# EAGLE design Cube-CTRL (EAGLE 5.11)
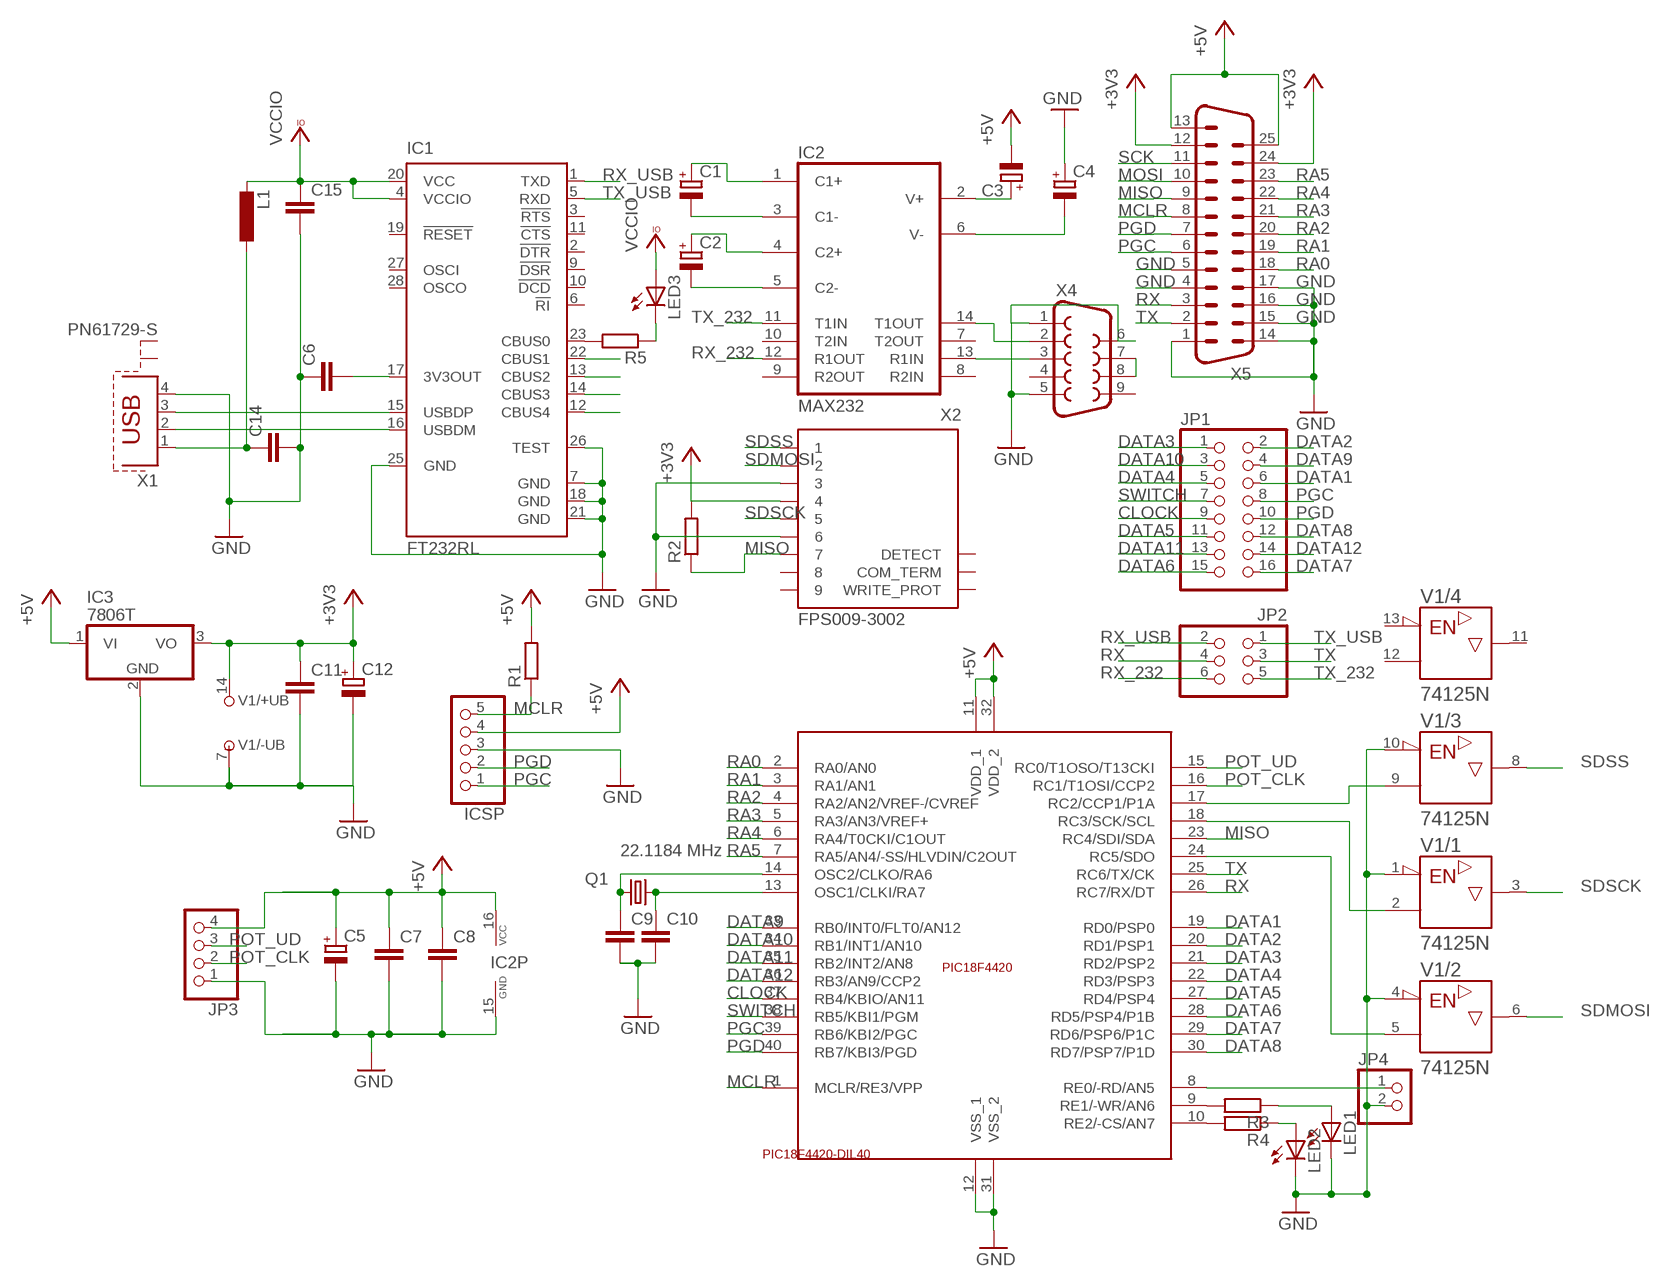
[diagram p0: schematic, sheet 1]

## Parts
C1  CPOL-EUE2-4  [E2-4]
C2  CPOL-EUE2-4  [E2-4]
C3  CPOL-EUE2-4  [E2-4]
C4  CPOL-EUE2-4  [E2-4]
C5  CPOL-EUE2.5-6  [E2,5-6]
C6  C-EU050-024X044  [C050-024X044]
C7  C-EU050-024X044  [C050-024X044]
C8  C-EU050-024X044  [C050-024X044]
C9  C-EU050-024X044  [C050-024X044]
C10  C-EU050-024X044  [C050-024X044]
C11  C-EU050-024X044  [C050-024X044]
C12  CPOL-EUE2.5-6  [E2,5-6]
C14  C-EU050-024X044  [C050-024X044]
C15  C-EU050-024X044  [C050-024X044]
IC1  FT232RL  [SSOP28]
IC2  MAX232  [DIL16]
IC3  7806T  [TO220H]
ICSP  PINHD-1X5  [1X05]
JP1  PINHD-2X8  [2X08]
JP2  PINHD-2X3  [2X03]
JP3  PINHD-1X4  [1X04]
JP4  PINHD-1X2  [1X02]
L1  L-EU0204/7  [0204/7]
LED1  LED3MM  [LED3MM]
LED2  LED3MM  [LED3MM]
LED3  LED3MM  [LED3MM]
Q1  22.1184 MHz  CRYSTALHC49S  [HC49/S]
R1  R-EU_0207/7  [0207/7]
R2  R-EU_0207/7  [0207/7]
R3  R-EU_0207/7  [0207/7]
R4  R-EU_0207/7  [0207/7]
R5  R-EU_0207/7  [0207/7]
U$1  PIC18F4420-DIL40  [DIL40]
V1  74125N  [DIL14]
X1  PN61729-S  [PN61729-S]
X2  FPS009-3002  [FPS009-3000]
X4  F09HP  [F09HP]
X5  M25H  [M25H]

## Nets
+3V3: C11.1 C12.+ IC3.3(VO) R2.2 V1.14(/+UB:+UB) X2.4 X5.12 X5.24
+5V [PWR]: C3.- C5.+ C7.1 C8.1 IC2.16(VCC) IC3.1(VI) ICSP.4 JP3.4 R1.2 U$1.11(VDD_1) U$1.32(VDD_2) X5.13 X5.25
CLOCK: JP1.9 U$1.37(RB4/KBIO/AN11)
DATA1: JP1.6 U$1.19(RD0/PSP0)
DATA2: JP1.2 U$1.20(RD1/PSP1)
DATA3: JP1.1 U$1.21(RD2/PSP2)
DATA4: JP1.5 U$1.22(RD3/PSP3)
DATA5: JP1.11 U$1.27(RD4/PSP4)
DATA6: JP1.15 U$1.28(RD5/PSP4/P1B)
DATA7: JP1.16 U$1.29(RD6/PSP6/P1C)
DATA8: JP1.12 U$1.30(RD7/PSP7/P1D)
DATA9: JP1.4 U$1.33(RB0/INT0/FLT0/AN12)
DATA10: JP1.3 U$1.34(RB1/INT1/AN10)
DATA11: JP1.13 U$1.35(RB2/INT2/AN8)
DATA12: JP1.14 U$1.36(RB3/AN9/CCP2)
GND [PWR]: C4.+ C5.- C6.1 C7.2 C8.2 C9.2 C10.2 C11.2 C12.- C14.2 C15.2 IC1.7(GND) IC1.18(GND) IC1.21(GND) IC1.25(GND) IC1.26(TEST) IC2.15(GND) IC3.2(GND) ICSP.3 JP3.1 JP4.2 LED1.K(C) LED2.K(C) U$1.12(VSS_1) U$1.31(VSS_2) V1.1(/1:!G) V1.4(/2:!G) V1.7(/-UB:-UB) V1.10(/3:!G) X1.4 X2.3 X2.6 X4.1 X4.5 X4.6 X5.1 X5.4 X5.5 X5.14 X5.15 X5.16 X5.17
MCLR: ICSP.5 R1.1 U$1.1(MCLR/RE3/VPP) X5.8
MISO: R2.1 U$1.23(RC4/SDI/SDA) X2.7 X5.9
MOSI: U$1.24(RC5/SDO) V1.5(/2:A) X5.10
N$1: IC1.15(USBDP) X1.3
N$2: IC1.16(USBDM) X1.2
N$3: C2.- IC2.5(C2-)
N$4: C2.+ IC2.4(C2+)
N$5: C1.- IC2.3(C1-)
N$6: C1.+ IC2.1(C1+)
N$7: C4.- IC2.6(V-)
N$8: C3.+ IC2.2(V+)
N$11: C10.1 Q1.2 U$1.13(OSC1/CLKI/RA7)
N$12: C9.1 Q1.1 U$1.14(OSC2/CLKO/RA6)
N$13: U$1.17(RC2/CCP1/P1A) V1.9(/3:A)
N$16: R3.2 U$1.9(RE1/-WR/AN6)
N$17: R4.2 U$1.10(RE2/-CS/AN7)
N$18: LED2.A R4.1
N$19: LED1.A R3.1
N$20: IC1.23(CBUS0) R5.2
N$21: IC1.22(CBUS1)
N$22: IC1.13(CBUS2)
N$23: IC1.14(CBUS3)
N$24: IC1.12(CBUS4)
N$25: IC2.14(T1OUT) X4.2
N$26: X4.7 X4.8
N$27: IC2.13(R1IN) X4.3
N$28: C6.2 IC1.17(3V3OUT)
N$29: JP4.1 U$1.8(RE0/-RD/AN5)
N$31: LED3.K(C) R5.1
PGC: ICSP.1 JP1.8 U$1.39(RB6/KBI2/PGC) X5.6
PGD: ICSP.2 JP1.10 U$1.40(RB7/KBI3/PGD) X5.7
POT_CLK: JP3.3 U$1.16(RC1/T1OSI/CCP2)
POT_UD: JP3.2 U$1.15(RC0/T1OSO/T13CKI)
RA0: U$1.2(RA0/AN0) X5.18
RA1: U$1.3(RA1/AN1) X5.19
RA2: U$1.4(RA2/AN2/VREF-/CVREF) X5.20
RA3: U$1.5(RA3/AN3/VREF+) X5.21
RA4: U$1.6(RA4/T0CKI/C1OUT) X5.22
RA5: U$1.7(RA5/AN4/-SS/HLVDIN/C2OUT) X5.23
RX: JP2.4 U$1.26(RC7/RX/DT) X5.3
RX_232: IC2.12(R1OUT) JP2.6
RX_USB: IC1.1(TXD) JP2.2
SCK: U$1.18(RC3/SCK/SCL) V1.2(/1:A) X5.11
SDMOSI: V1.6(/2:Y) X2.2
SDSCK: V1.3(/1:Y) X2.5
SDSS: V1.8(/3:Y) X2.1
SWITCH: JP1.7 U$1.38(RB5/KBI1/PGM)
TX: JP2.3 U$1.25(RC6/TX/CK) X5.2
TX_232: IC2.11(T1IN) JP2.5
TX_USB: IC1.5(RXD) JP2.1
VCCIO: C15.1 IC1.4(VCCIO) IC1.20(VCC) L1.2 LED3.A
VUSB: C14.1 L1.1 X1.1
Unconnected: IC1.2(!DTR) IC1.3(!RTS) IC1.6(!RI) IC1.9(!DSR) IC1.10(!DCD) IC1.11(!CTS) IC1.19(!RESET) IC1.27(OSCI) IC1.28(OSCO) IC2.7(T2OUT) IC2.8(R2IN) IC2.9(R2OUT) IC2.10(T2IN) V1.11(/4:Y) V1.12(/4:A) V1.13(/4:!G) X1.S1 X1.S2 X2.8 X2.9 X2.COM_TERM X2.DETECT X2.WRITE_PROT X4.4 X4.9

## Library data of the parts
C1-C5 C12 = rcl:CPOL-EU: POLARIZED CAPACITOR, European symbol
C6-C11 C14 C15 = rcl:C-EU: CAPACITOR, European symbol
IC1 = ftdichip:FT232R: Source: http://www.ftdichip.com/Documents/DataSheets/DS_FT232R_v104.pdf; MPN: FT232RL; OC_FARNELL: 1146032; OC_NEWARK: 91K9918
IC2 = maxim:MAX232: RS232 TRANSEIVER; MF: MAXIM; MPN: MAX232ACPE+; OC_FARNELL: 9723773; OC_NEWARK: 68K4544
IC3 = linear:78*: Positive VOLTAGE REGULATOR Source: http://cache.national.com/ds/LM/LM78L05.pdf http://www.fairchildsemi.com/ds/LM/LM7805.pdf
ICSP = pinhead:PINHD-1X5: PIN HEADER
JP1 = pinhead:PINHD-2X8: PIN HEADER
JP2 = pinhead:PINHD-2X3: PIN HEADER
JP3 = pinhead:PINHD-1X4: PIN HEADER
JP4 = pinhead:PINHD-1X2: PIN HEADER
L1 = rcl:L-EU: INDUCTOR, European symbol
LED1-LED3 = led:LED: LED OSRAM: - CHIPLED LG R971, LG N971, LY N971, LG Q971, LY Q971, LO R971, LY R971 LH N974, LH R974 LS Q976, LO Q976, LY Q976 LO Q996 - Hyper CHIPLED LW Q18S LB Q993, LB Q99A, LB R99A - SideLED LS A670, LO A670, LY A670, LG A670, LP A670 LB A673, LV A673, LT A673, LW A673 LH A674 LY A675 LS A676, LA A676, LO A676, LY A676, LW A676 LS A679, LY A679, LG A679 - Hyper Micro SIDELED® LS Y876, LA Y876, LO Y876, LY Y876 LT Y87S - SmartLED LW L88C, LW L88S LB L89C, LB L89S, LG L890 LS L89K, LO L89K, LY L89K LS L896, LA L896, LO L896, LY L896 - TOPLED LS T670, LO T670, LY T670, LG T670, LP T670 LSG T670, LSP T670, LSY T670, LOP T670, LYG T670 LG T671, LOG T671, LSG T671 LB T673, LV T673, LT T673, LW T673 LH T674 LS T676, LA T676, LO T676, LY T676, LB T676, LH T676, LSB T676, LW T676 LB T67C, LV T67C, LT T67C, LS T67K, LO T67K, LY T67K, LW E67C LS E67B, LA E67B, LO E67B, LY E67B, LB E67C, LV E67C, LT E67C LW T67C LS T679, LY T679, LG T679 LS T770, LO T770, LY T770, LG T770, LP T770 LB T773, LV T773, LT T773, LW T773 LH T774 LS E675, LA E675, LY E675, LS T675 LS T776, LA T776, LO T776, LY T776, LB T776 LHGB T686 LT T68C, LB T68C - Hyper Mini TOPLED® LB M676 - Mini TOPLED Santana® LG M470 LS M47K, LO M47K, LY M47K Source: http://www.osram.convergy.de LUXEON: - LUMILED® LXK2-PW12-R00, LXK2-PW12-S00, LXK2-PW14-U00, LXK2-PW14-V00 LXK2-PM12-R00, LXK2-PM12-S00, LXK2-PM14-U00 LXK2-PE12-Q00, LXK2-PE12-R00, LXK2-PE12-S00, LXK2-PE14-T00, LXK2-PE14-U00 LXK2-PB12-K00, LXK2-PB12-L00, LXK2-PB12-M00, LXK2-PB14-N00, LXK2-PB14-P00, LXK2-PB14-Q00 LXK2-PR12-L00, LXK2-PR12-M00, LXK2-PR14-Q00, LXK2-PR14-R00 LXK2-PD12-Q00, LXK2-PD12-R00, LXK2-PD12-S00 LXK2-PH12-R00, LXK2-PH12-S00 LXK2-PL12-P00, LXK2-PL12-Q00, LXK2-PL12-R00 Source: www.luxeon.com KINGBRIGHT: KA-3528ASYC Source: www.kingbright.com
Q1 = crystal:CRYSTAL: CRYSTAL; OC_FARNELL: 1667008; OC_NEWARK: unknown
R1-R5 = rcl:R-EU_: RESISTOR, European symbol
U$1 = PIC18F4420:PIC18F4420-DIL40
V1 = 74ttl-din:74*125: Quad bus BUFFER, 3-state
X1 = con-berg:PN61729-S: BERG USB connector; OC_FARNELL: unknown; OC_NEWARK: unknown
X2 = con-yamaichi:FPS009-300*: SD Card and MMC Reader (Manual Insertion) Source: http://www.yamaichi.de/pdf/c_fps009_3000.pdf; OC_FARNELL: unknown; OC_NEWARK: unknown
X4 = con-subd:F09: SUB-D; OC_FARNELL: unknown; OC_NEWARK: unknown
X5 = con-subd:M25: SUB-D; OC_FARNELL: unknown; OC_NEWARK: unknown

## Net classes
0 default: width 0.406 mm
1 PWR: width 0.61 mm

## Board
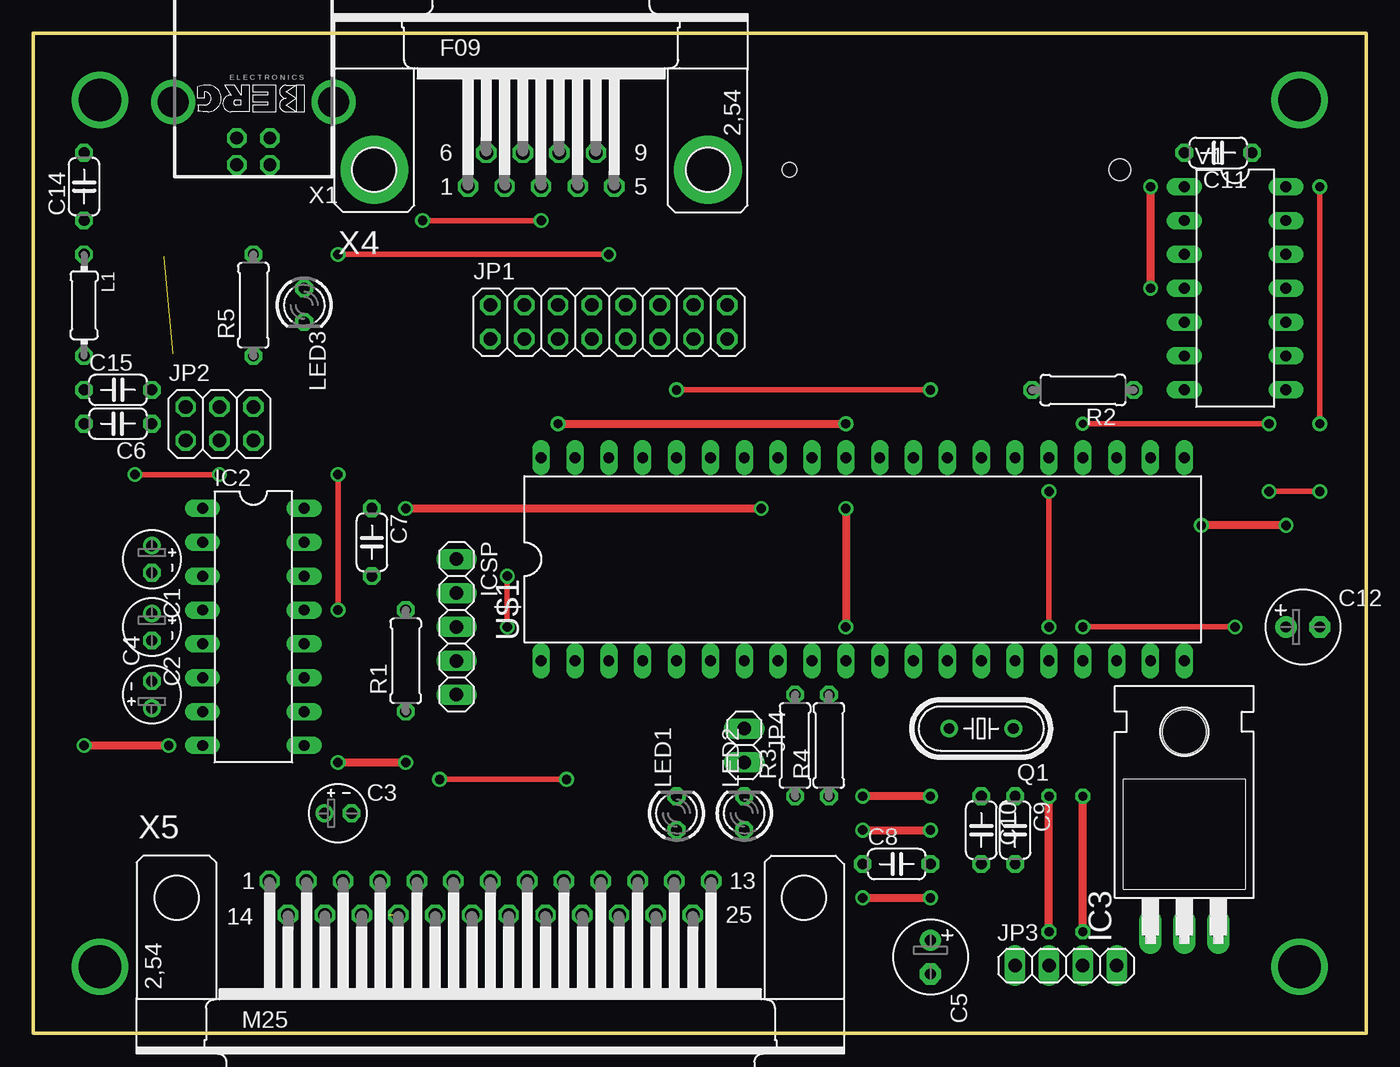
[diagram p1: board, top side]
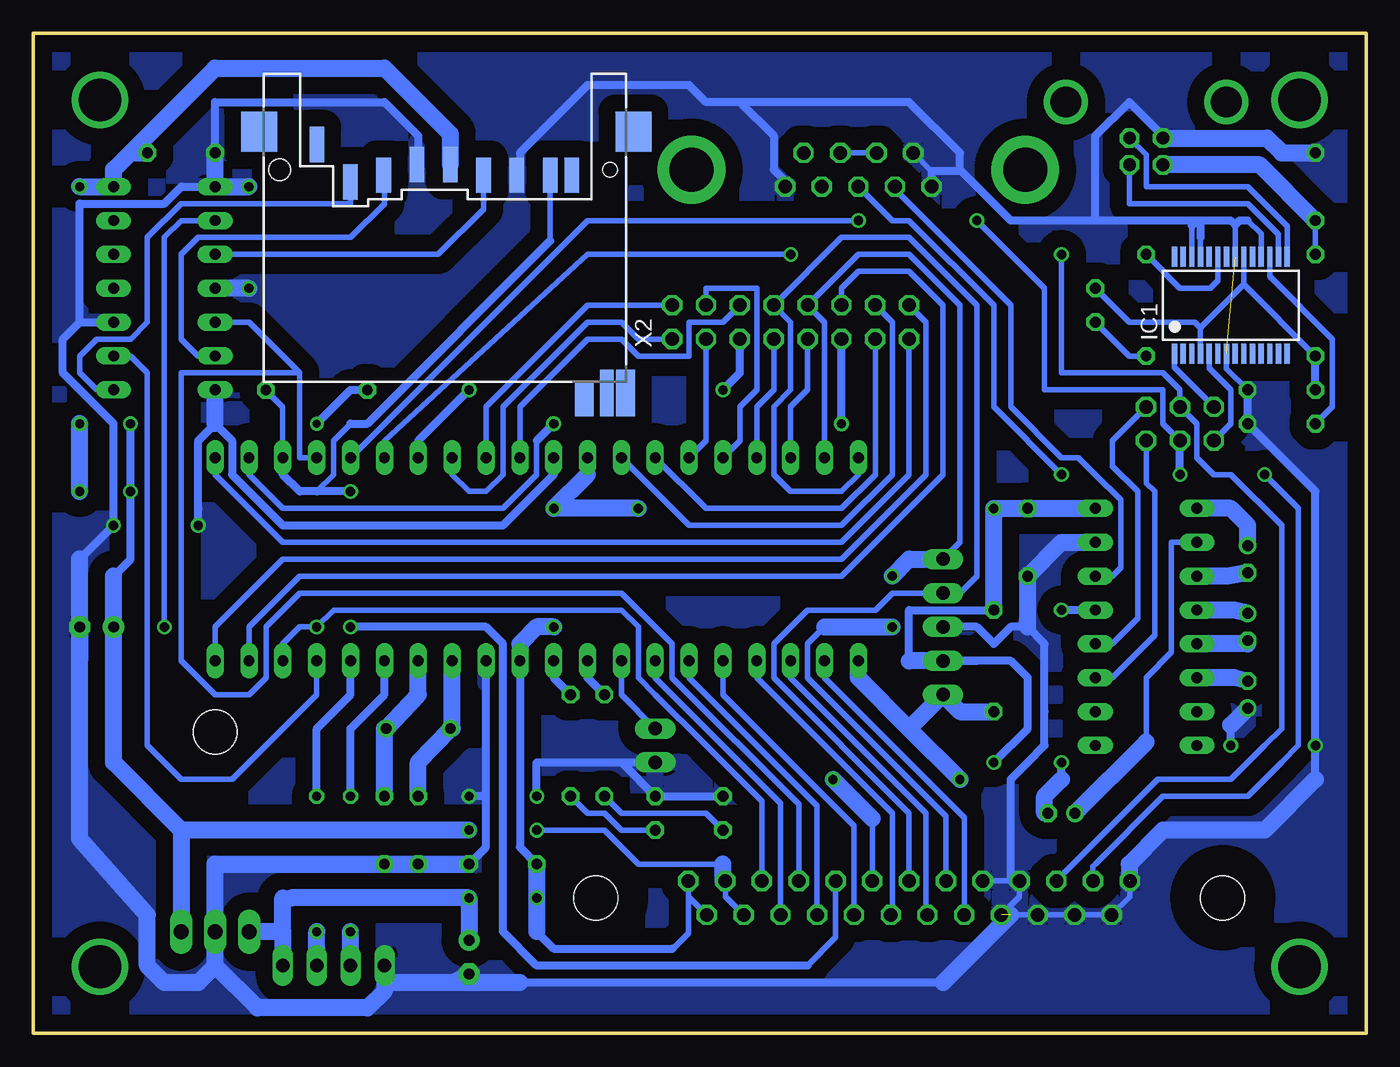
[diagram p2: board, bottom side, seen from below]

Size 100 x 75 mm. Coordinates in mm from the lower left corner, seen from the top.
Outline: 0,0 100,0 100,75 0,75 0,0
Copper layers (1*16): Top 0.035mm / dielectric 1.5mm / Bottom 0.035mm
Design rules "default": minimum track width 10mil, minimum drill 24mil, track to track 8mil, track to pad 8mil, pad to pad 8mil, via to via 8mil, smd to smd 8mil, copper to edge 40mil, drill to drill 8mil, minimum pad ring 10mil, minimum via ring 8mil, stop-mask expansion 4mil, vias tented up to drill 0mil, thermal gap 10mil

### Footprints (pad centres in the part's own frame; a part is rotated, then mirrored left to right if it is on the bottom)
E2-4 = drill 0.813 pad 1.27 round: + -1.016,0 | drill 0.813 pad 1.27 octagon: - 1.016,0
E2,5-6 = drill 0.813 pad 1.6 round: + -1.27,0 | drill 0.813 pad 1.6 octagon: - 1.27,0
C050-024X044 = drill 0.813 octagon: 1 -2.54,0; 2 2.54,0
SSOP28 = smd 0.4 x 1.5: 1 -4.225,-3.625; 2 -3.575,-3.625; 3 -2.925,-3.625; 4 -2.275,-3.625; 5 -1.625,-3.625; 6 -0.975,-3.625; 7 -0.325,-3.625; 8 0.325,-3.625; 9 0.975,-3.625; 10 1.625,-3.625; 11 2.275,-3.625; 12 2.925,-3.625; 13 3.575,-3.625; 14 4.225,-3.625; 15 4.225,3.625; 16 3.575,3.625; 17 2.925,3.625; 18 2.275,3.625; 19 1.625,3.625; 20 0.975,3.625; 21 0.325,3.625; 22 -0.325,3.625; 23 -0.975,3.625; 24 -1.625,3.625; 25 -2.275,3.625; 26 -2.925,3.625; 27 -3.575,3.625; 28 -4.225,3.625
DIL16 = drill 0.813 long: 1 -8.89,-3.81; 2 -6.35,-3.81; 3 -3.81,-3.81; 4 -1.27,-3.81; 5 1.27,-3.81; 6 3.81,-3.81; 7 6.35,-3.81; 8 8.89,-3.81; 9 8.89,3.81; 10 6.35,3.81; 11 3.81,3.81; 12 1.27,3.81; 13 -1.27,3.81; 14 -3.81,3.81; 15 -6.35,3.81; 16 -8.89,3.81
TO220H = drill 1.118 long: 1 -2.54,-10.16; 2 0,-10.16; 3 2.54,-10.16 | hole 3.302: 0,4.826
1X05 = drill 1.016 long: 1 -5.08,0; 2 -2.54,0; 3 0,0; 4 2.54,0; 5 5.08,0
2X08 = drill 1.016 octagon: 1 -8.89,-1.27; 2 -8.89,1.27; 3 -6.35,-1.27; 4 -6.35,1.27; 5 -3.81,-1.27; 6 -3.81,1.27; 7 -1.27,-1.27; 8 -1.27,1.27; 9 1.27,-1.27; 10 1.27,1.27; 11 3.81,-1.27; 12 3.81,1.27; 13 6.35,-1.27; 14 6.35,1.27; 15 8.89,-1.27; 16 8.89,1.27
2X03 = drill 1.016 octagon: 1 -2.54,-1.27; 2 -2.54,1.27; 3 0,-1.27; 4 0,1.27; 5 2.54,-1.27; 6 2.54,1.27
1X04 = drill 1.016 long: 1 -3.81,0; 2 -1.27,0; 3 1.27,0; 4 3.81,0
1X02 = drill 1.016 long: 1 -1.27,0; 2 1.27,0
0204/7 = drill 0.813 octagon: 1 -3.81,0; 2 3.81,0
LED3MM = drill 0.813 octagon: A -1.27,0; K 1.27,0
HC49/S = drill 0.813 round: 1 -2.413,0; 2 2.413,0
0207/7 = drill 0.813 octagon: 1 -3.81,0; 2 3.81,0
DIL40 = drill 0.813 long: 1 -24.13,-7.62; 2 -21.59,-7.62; 3 -19.05,-7.62; 4 -16.51,-7.62; 5 -13.97,-7.62; 6 -11.43,-7.62; 7 -8.89,-7.62; 8 -6.35,-7.62; 9 -3.81,-7.62; 10 -1.27,-7.62; 11 1.27,-7.62; 12 3.81,-7.62; 13 6.35,-7.62; 14 8.89,-7.62; 15 11.43,-7.62; 16 13.97,-7.62; 17 16.51,-7.62; 18 19.05,-7.62; 19 21.59,-7.62; 20 24.13,-7.62; 21 24.13,7.62; 22 21.59,7.62; 23 19.05,7.62; 24 16.51,7.62; 25 13.97,7.62; 26 11.43,7.62; 27 8.89,7.62; 28 6.35,7.62; 29 3.81,7.62; 30 1.27,7.62; 31 -1.27,7.62; 32 -3.81,7.62; 33 -6.35,7.62; 34 -8.89,7.62; 35 -11.43,7.62; 36 -13.97,7.62; 37 -16.51,7.62; 38 -19.05,7.62; 39 -21.59,7.62; 40 -24.13,7.62
DIL14 = drill 0.813 long: 1 -7.62,-3.81; 2 -5.08,-3.81; 3 -2.54,-3.81; 4 0,-3.81; 5 2.54,-3.81; 6 5.08,-3.81; 7 7.62,-3.81; 8 7.62,3.81; 9 5.08,3.81; 10 2.54,3.81; 11 0,3.81; 12 -2.54,3.81; 13 -5.08,3.81; 14 -7.62,3.81
PN61729-S = drill 0.95 octagon: 1 1.25,4.71; 2 -1.25,4.71; 3 -1.25,2.71; 4 1.25,2.71 | drill 2.3 pad 2.9 round: S1 -6.02,0; S2 6.02,0
FPS009-3000 = smd 2.65 x 1.1: 1 -0.915,-5.3; 2 -0.415,-7.8; 3 0.385,-10.3; 4 0.385,-12.8; 5 -0.415,-15.3; 6 -0.415,-17.8; 7 -0.415,-20.3; 8 -0.415,-21.925; 9 1.885,-2.8 | smd 3.5 x 1: COM_TERM -16.75,-24.55 | smd 2.5 x 1.4: DETECT -17.25,-22.85 | smd 3 x 2.7: M1 2.85,1.55; M2 2.85,-26.55 | smd 3.5 x 1.4: WRITE_PROT -16.75,-25.95 | hole 1.6: 0,0 | hole 1.1: 0,-24.8
F09HP = drill 1.016 octagon: 1 -5.486,-1.27; 2 -2.743,-1.27; 3 0,-1.27; 4 2.743,-1.27; 5 5.486,-1.27; 6 -4.115,1.27; 7 -1.372,1.27; 8 1.372,1.27; 9 4.115,1.27 | drill 3.302 pad 5.08 round: G1 -12.522,0; G2 12.522,0
M25H = drill 1.016 octagon: 1 -16.561,1.27; 2 -13.792,1.27; 3 -11.049,1.27; 4 -8.28,1.27; 5 -5.512,1.27; 6 -2.769,1.27; 7 0,1.27; 8 2.769,1.27; 9 5.512,1.27; 10 8.28,1.27; 11 11.049,1.27; 12 13.792,1.27; 13 16.561,1.27; 14 -15.189,-1.27; 15 -12.421,-1.27; 16 -9.652,-1.27; 17 -6.909,-1.27; 18 -4.14,-1.27; 19 -1.372,-1.27; 20 1.372,-1.27; 21 4.14,-1.27; 22 6.909,-1.27; 23 9.652,-1.27; 24 12.421,-1.27; 25 15.189,-1.27 | hole 3.302: 23.52,0; -23.52,0

### Placement (x,y rotation side)
C1  8.89,35.56 270 top
C2  8.89,30.48 270 top
C3  22.86,16.51 0 top
C4  8.89,25.4 90 top
C5  67.31,5.71 270 top
C6  6.35,45.72 180 top
C7  25.4,36.83 270 top
C8  64.77,12.7 0 top
C9  73.66,15.24 270 top
C10  71.12,15.24 270 top
C11  88.9,66.04 180 top
C12  95.25,30.48 0 top
C14  3.81,63.5 90 top
C15  6.35,48.26 0 top
IC1  10.16,54.61 0 bottom
IC2  16.51,30.48 270 top
IC3  86.36,17.78 0 top
ICSP  31.75,30.48 270 top
JP1  43.18,53.34 0 top
JP2  13.97,45.72 0 top
JP3  77.47,5.08 0 top
JP4  53.34,21.59 270 top
L1  3.81,54.61 270 top
LED1  48.26,16.51 90 top
LED2  53.34,16.51 90 top
LED3  20.32,54.61 270 top
Q1  71.12,22.86 180 top
R1  27.94,27.94 90 top
R2  78.74,48.25 180 top
R3  57.15,21.59 90 top
R4  59.69,21.59 90 top
R5  16.51,54.61 90 top
U$1  62.23,35.56 0 top
V1  90.17,55.88 270 top
X1  16.51,69.85 180 top
X2  81.52,64.77 90 bottom
X4  38.1,64.77 0 top
X5  34.29,10.16 0 top

### Tracks (layer width: path | path; a pad name or v marks a point on that pad's centre or on a via)
+3V3  (via drill 0.61, 0.7)
  Top 0.406: v92.71,40.64 v96.52,40.64 | v96.52,45.72 v96.52,63.5 | v92.71,45.72 v78.74,45.72
  Top 0.61: v62.23,15.24 v67.31,15.24
  Bottom 0.406: 74.94,48.26 R2.2 | 48.26,12.7 54.61,12.7 57.15,15.24 v62.23,15.24 | 48.26,11.43 X5.12 48.08,10.26 X5.24
  Bottom 0.61: 93.98,34.29 92.71,35.56 v92.71,40.64 v92.71,45.72 | v78.74,45.72 76.2,48.26 74.94,48.26
  Bottom 1.27: X2.4 68.72,67.45 73.66,72.39 86.36,72.39 92.71,66.04 | 92.71,66.04 93.98,64.77 V1.14 v96.52,63.5 | IC3.3 88.9,13.97 88.9,15.24 | 88.9,15.24 93.98,20.32 C12.+ 93.98,33.02 93.98,34.29 | v96.52,40.64 v96.52,45.72 | v67.31,15.24 80.01,15.24 88.9,15.24 | 48.26,11.43 48.26,12.7 | 92.71,66.04 C11.1
+5V  (via drill 0.7)
  Top 0.61: v62.23,10.16 v67.31,10.16 | v60.96,39.37 v60.96,30.48 | v22.86,20.32 v27.94,20.32 | v27.94,39.37 v54.61,39.37
  Bottom 0.406: X5.25 50.85,10.26 X5.13 50.85,7.52 52.02,6.35
  Bottom 0.61: U$1.11 63.5,13.97 C8.1 | 58.42,41.91 U$1.32 | 34.29,27.94 34.29,31.75 R1.2 | 29.21,27.94 ICSP.4 26.67,27.94 25.4,26.67 25.4,22.86 v27.94,20.32 | 24.13,39.37 IC2.16 | 62.23,7.62 60.96,6.35 52.02,6.35 | 22.86,19.05 v22.86,20.32 | 81.28,7.62 81.28,9.53 80.64,10.16
  Bottom 0.762: C3.- 24.13,16.51
  Bottom 1.27: U$1.11 63.5,29.21 62.23,30.48 v60.96,30.48 | 58.42,41.91 v60.96,39.37 v54.61,39.37 | ICSP.4 34.29,27.94 | R1.2 v27.94,39.37 C7.1 24.13,39.37 IC2.16 | 62.23,7.62 62.23,8.89 v62.23,10.16 C8.1 | 81.28,7.62 81.28,10.16 | 81.28,7.62 JP3.4 | 81.28,7.62 IC3.1 | 24.13,16.51 24.13,17.78 22.86,19.05 | C5.+ v67.31,10.16 80.64,10.16
CLOCK
  Bottom 0.406: JP1.9 44.45,48.26 45.72,46.99 U$1.37
DATA1
  Bottom 0.406: U$1.19 83.82,30.48 80.01,34.29 39.37,34.29 31.75,41.91 31.75,44.45 31.75,49.53 31.75,54.61 34.29,57.15 38.1,57.15 39.37,55.88 JP1.6
DATA2
  Bottom 0.406: U$1.20 86.36,30.48 81.28,35.56 39.37,35.56 33.02,41.91 33.02,44.45 33.02,49.53 33.02,53.34 JP1.2
DATA3
  Bottom 0.406: U$1.21 86.36,41.91 81.28,36.83 39.37,36.83 34.29,41.91 34.29,44.45 34.29,49.53 JP1.1
DATA4  (via drill 0.7)
  Top 0.61: v39.37,45.72 v60.96,45.72
  Bottom 0.406: 62.23,44.45 62.23,41.91 64.77,39.37 80.01,39.37 81.28,39.37 83.82,41.91 U$1.22
  Bottom 0.61: v60.96,45.72 62.23,44.45 | v39.37,45.72 JP1.5
DATA5  (via drill 0.7)
  Top 0.406: v48.26,48.26 v67.31,48.26
  Bottom 0.61: U$1.27 71.12,44.45 v67.31,48.26 | JP1.11 46.99,49.53 v48.26,48.26
DATA6
  Bottom 0.406: U$1.28 68.58,41.91 67.31,40.64 66.04,40.64 64.77,41.91 64.77,46.99 58.42,53.34 55.88,53.34 54.61,52.07 JP1.15
DATA7
  Bottom 0.406: U$1.29 66.04,46.99 58.42,54.61 JP1.16
DATA8
  Bottom 0.406: JP1.12 48.26,53.34 49.53,53.34 50.8,53.34 50.8,50.8 54.61,50.8 55.88,52.07 58.42,52.07 63.5,46.99 63.5,44.45 U$1.30
DATA9
  Bottom 0.406: U$1.33 50.8,38.1 39.37,38.1 35.56,41.91 35.56,44.45 35.56,49.53 35.56,53.34 JP1.4
DATA10
  Bottom 0.406: U$1.34 49.53,39.37 39.37,39.37 36.83,41.91 36.83,44.45 36.83,49.53 JP1.3
DATA11
  Bottom 0.406: U$1.35 49.53,44.45 JP1.13
DATA12
  Bottom 0.406: U$1.36 46.99,44.45 46.99,46.99 45.72,48.26 45.72,55.88 49.53,55.88 JP1.14
GND  (via drill 0.7)  (3 unrouted)
  Top 0.61: v93.98,38.1 v87.63,38.1 | v67.31,17.78 v62.23,17.78 | v83.82,63.5 v83.82,55.88 | v3.81,21.59 v10.16,21.59
  Bottom 0.406: 13.09,59.57 IC1.26 13.09,60.58 | 12.44,59.68 IC1.25 | IC1.21 9.84,59.49 9.84,60.63 | IC1.7 10.48,49.85 C15.2 | IC1.18 7.88,59.95 8.89,60.96 | 32.61,64.67 X4.6 | X5.1 17.73,10.26 X5.14 X5.15 X5.16 X5.17 26.01,10.26 X5.4 | X5.4 26.67,11.43 | 26.67,11.43 X5.5 | X5.4 26.67,11.43
  Bottom 0.61: 31.75,3.81 63.5,3.81 | X2.6 63.5,64.58 63.5,66.04 58.42,71.12 50.8,71.12 49.53,69.85 46.99,69.85 | U$1.31 60.96,41.91 64.77,38.1 81.28,38.1 85.09,41.91 85.09,44.45 86.36,45.72 87.63,44.45 87.63,39.37 v87.63,38.1 | 71.12,65.06 X2.3 71.12,65.25 71.12,66.04 71.12,67.31 73.66,69.85 86.36,69.85 C11.2 | ICSP.3 29.21,30.48 27.94,29.21 26.67,30.48 25.4,30.48 24.13,29.21 24.13,24.13 | C8.2 66.04,13.97 66.04,17.78 | v83.82,63.5 V1.1 88.9,63.5 90.17,62.23 96.52,62.23 96.52,53.34 | 96.52,53.34 V1.10 | 96.52,53.34 97.79,52.07 97.79,49.53 93.98,45.72 v93.98,38.1 96.52,35.56 | 46.99,69.85 34.29,69.85 30.48,66.04 30.48,64.77 | 30.48,64.77 26.67,60.96 24.13,60.96 20.32,60.96 | 20.32,60.96 19.05,60.96 16.51,60.96 13.21,60.96 12.7,60.96 | 12.7,60.96 12.45,60.96 10.16,60.96 9.84,60.63 9.51,60.96 8.89,60.96 | C15.2 C6.1 3.81,40.64 v3.81,21.59 3.81,19.05 | v10.16,21.59 10.16,23.11 | 12.44,59.68 12.44,60.7 12.7,60.96 | 12.7,60.96 13.09,60.58 | 24.13,21.59 25.4,20.32 26.67,19.05 26.67,11.43 | 24.13,21.59 24.13,24.13 | 73.03,3.81 73.66,4.45 | LED1.K LED2.K 55.88,20.32 | v62.23,17.78 62.23,20.32 55.88,20.32 | 55.88,20.32 JP4.2 | 20.32,60.96 20.32,67.31 17.78,69.85 15.26,67.33 X1.4 | 66.04,17.78 U$1.12 | 66.04,17.78 v67.31,17.78 | 24.13,21.59 24.13,24.13 | X4.1 32.61,64.67 30.58,64.67 30.48,64.77 | X4.5 43.59,63.91 44.45,64.77 44.45,67.31 46.99,69.85
  Bottom 1.27: 31.75,3.81 26.67,8.89 | C8.2 C10.2 C9.2 86.36,12.7 IC3.2 86.36,5.08 | IC2.15 22.86,36.83 C7.2 25.4,30.48 | 86.36,5.08 83.19,1.91 74.93,1.91 73.66,3.17 73.66,4.45 JP3.1 | v83.82,55.88 V1.4 | v83.82,63.5 V1.1 C11.2 | 96.52,35.56 96.52,27.94 C12.- 96.52,14.61 91.44,8.89 91.44,5.08 90.17,3.81 87.63,3.81 86.36,5.08 | 10.16,23.11 C4.+ | 86.36,45.72 V1.7 | 17.78,11.43 17.78,12.7 15.24,15.24 7.62,15.24 3.81,19.05 | 63.5,3.81 68.58,3.81 | 68.58,3.81 73.03,3.81 | 68.58,3.81 C5.- | X1.4 7.45,67.14 6.35,66.04 C14.2
  pour Bottom (isolate 1.27): 100.33,0 0,0 0,74.93 100.33,74.93
MCLR  (via drill 0.7)
  Top 0.406: v30.48,19.05 v40.01,19.05
  Bottom 0.406: 37.06,16.1 X5.8
  Bottom 1.27: R1.1 30.48,24.13 ICSP.5 34.29,22.86 | U$1.1 38.1,26.67 34.29,22.86 | v30.48,19.05 34.29,22.86 | v40.01,19.05 37.06,16.1
MISO  (via drill 0.7)
  Top 0.406: v76.2,30.48 v76.2,40.64
  Bottom 0.406: 61.22,59.43 61.22,60.96 X2.7 | 76.2,45.72 77.47,44.45 77.47,41.91 78.74,40.64 | U$1.23 81.28,46.98 R2.1 | 41.91,5.08 39.8,7.19 X5.9
  Bottom 0.61: 41.91,5.08 58.42,5.08 62.23,5.08 64.77,7.62 64.77,10.16 64.77,11.43 64.77,16.51 64.77,19.05 64.77,29.21 66.04,30.48 v76.2,30.48 | 61.22,59.43 62.23,58.42 73.66,46.99 74.93,45.72 76.2,45.72 | U$1.23 81.28,41.91 80.01,40.64 78.74,40.64 v76.2,40.64
MOSI
  Bottom 0.406: 80.01,49.53 83.82,53.34 V1.5 | U$1.24 80.01,43.18 80.01,49.53 | 80.01,49.53 88.9,49.53 88.9,27.94 86.36,25.4 83.82,25.4 82.55,26.67 82.55,30.48 80.01,33.02 55.88,33.02 54.61,31.75 52.07,29.21 52.07,26.67 42.57,17.17 X5.10
N$1
  Bottom 0.406: X1.3 16.51,65.89 16.51,64.77 16.51,63.5 8.89,63.5 5.93,60.55 IC1.15
N$2
  Bottom 0.406: X1.2 17.76,63.48 17.78,62.23 8.89,62.23 6.58,59.92 IC1.16
N$3
  Bottom 0.406: C2.- 8.89,29.21
  Bottom 1.27: 8.89,29.21 IC2.5
N$4
  Bottom 1.27: IC2.4 9.91,31.75 C2.+
N$5
  Bottom 1.27: IC2.3 10.41,34.29 C1.-
N$6
  Bottom 1.27: C1.+ 8.89,38.1 10.16,39.37 IC2.1
N$7
  Bottom 1.27: IC2.6 9.91,26.67 C4.-
N$8
  Bottom 0.406: IC2.2 14.61,36.83 14.61,28.57 16.51,26.67 16.51,21.84
  Bottom 1.27: C3.+ 16.51,21.84
N$9  (via drill 3.2)
  other vias: 5,70
N$10  (via drill 3.2)
  other vias: 5,5
N$11
  Bottom 0.406: Q1.2 68.58,22.86
  Bottom 1.27: 68.58,22.86 U$1.13 | Q1.2 71.12,20.32 C10.1
N$12
  Bottom 0.406: Q1.1 73.66,22.73 73.66,22.86
  Bottom 1.27: Q1.1 71.12,25.4 U$1.14 | 73.66,22.86 73.66,21.59 C9.1
N$13
  Bottom 0.406: U$1.17 78.74,25.4 81.28,22.86 85.09,19.05 88.9,19.05 91.44,21.59 91.44,44.45 91.44,49.53 92.71,50.8 V1.9
N$14  (via drill 3.2)
  other vias: 95,5
N$15  (via drill 3.2)
  other vias: 95,70
N$16
  Bottom 0.61: R3.2 58.42,26.67 U$1.9
N$17
  Bottom 0.61: R4.2 60.96,26.67 U$1.10
N$18
  Bottom 0.406: R4.1 58.42,16.51 57.15,16.51 55.88,15.24 LED2.A
N$19
  Bottom 0.406: R3.1 55.88,16.51 49.53,16.51 LED1.A
N$20
  Bottom 0.406: IC1.23 11.13,56.43 11.68,55.88 13.97,55.88 R5.2
N$25
  Bottom 0.406: IC2.14 19.05,34.29 18.41,34.92 18.41,40.01 20.32,41.91 21.59,43.18 22.86,43.18 26.67,46.99 26.67,54.61 35.36,63.3 X4.2
N$26
  Bottom 0.406: X4.7 X4.8
N$27  (via drill 0.7)
  Top 0.406: v22.86,31.75 v22.86,41.91
  Bottom 0.406: X4.3 35.56,60.96 34.29,60.96 27.94,54.61 27.94,46.99 v22.86,41.91
  Bottom 0.61: IC2.13 v22.86,31.75
N$28
  Bottom 0.406: IC1.17 7.24,56.77 2.54,52.07 2.54,46.99 C6.2
N$29
  Bottom 0.406: JP4.1 55.88,25.4 U$1.8
N$31
  Bottom 0.406: R5.1 17.78,50.8 LED3.K
PGC  (via drill 0.7)
  Top 0.406: v35.56,30.48 v35.56,34.29
  Bottom 0.406: 40.64,45.72 U$1.39 40.64,48.26 40.64,53.34 JP1.8 38.1,58.42 34.29,58.42 30.48,54.61 30.48,49.53 30.48,44.45 30.48,36.83 ICSP.1 | 40.64,30.48 41.91,29.21 41.91,26.67 31.52,16.28 X5.6
  Bottom 1.27: 40.64,30.48 v35.56,30.48 | ICSP.1 34.29,35.56 v35.56,34.29
PGD
  Bottom 0.406: U$1.40 38.1,41.91 39.37,40.64 43.18,40.64 44.45,41.91 44.45,46.99 43.18,48.26 43.18,53.34 JP1.10 39.37,59.69 34.29,59.69 29.21,54.61 29.21,48.26 29.21,44.45 29.21,43.18 29.21,34.29 30.48,33.02 ICSP.2 | 35.56,33.02 36.83,31.75 41.91,31.75 44.45,29.21 44.45,26.67 34.29,16.51 X5.7 | 35.56,33.02 ICSP.2 | 35.56,33.02 ICSP.2
POT_CLK  (via drill 0.7)
  Top 0.61: v78.74,7.62 v78.74,17.78
  Bottom 0.406: JP3.3 78.74,6.35
  Bottom 0.61: U$1.16 76.2,25.4 78.74,22.86 v78.74,17.78
  Bottom 1.27: 78.74,6.35 v78.74,7.62
POT_UD  (via drill 0.7)
  Top 0.61: v76.2,7.62 v76.2,17.78
  Bottom 0.406: JP3.2 76.2,6.35
  Bottom 0.61: U$1.15 73.66,25.4 76.2,22.86 76.2,21.59 v76.2,17.78
  Bottom 1.27: 76.2,6.35 v76.2,7.62
RA0
  Bottom 0.406: U$1.2 40.64,26.67 33.02,19.05 30.15,16.18 X5.18
RA1
  Bottom 0.406: U$1.3 43.18,26.67 33.02,16.51 33.02,8.99 X5.19
RA2
  Bottom 0.406: U$1.4 45.72,26.67 35.56,16.51 35.56,12.7 35.56,8.99 X5.20
RA3
  Bottom 0.406: U$1.5 48.26,25.4 38.43,15.57 38.43,13.03 X5.21
RA4
  Bottom 0.406: 50.8,26.67 U$1.6 50.8,26.67 | 50.8,26.67 41.2,17.07 41.2,13.26 X5.22
RA5
  Bottom 0.406: 53.34,26.67 U$1.7 53.34,26.67 | 53.34,26.67 43.94,17.27 X5.23
RX  (via drill 0.7)
  Top 0.406: v22.86,58.42 v43.18,58.42
  Bottom 0.406: U$1.26 73.66,44.45 58.42,58.42 52.07,58.42 v43.18,58.42 | v22.86,58.42 22.86,49.53 15.24,49.53 13.97,48.26 JP2.4 12.7,45.72 12.7,43.18 11.43,41.91 10.16,41.91 6.35,38.1 6.35,30.48 6.35,29.21 6.35,22.86 7.62,21.59 10.16,19.05 15.62,19.05 X5.3
RX_232
  Bottom 0.406: IC2.12 19.05,29.21 17.14,31.11 17.14,34.29 17.14,40.64 19.05,42.55 19.05,44.45 JP2.6
RX_USB
  Bottom 0.406: JP2.2 14.38,49.95 IC1.1
SCK  (via drill 0.7)
  Top 0.406: v78.74,30.48 v90.17,30.48
  Bottom 0.406: U$1.18 81.28,29.21 80.01,30.48 v78.74,30.48 77.47,31.75 60.96,31.75 55.88,31.75 54.61,30.48 54.61,26.67 53.34,25.4 49.53,21.59 45.34,17.4 X5.11 | V1.2 88.9,60.96 90.17,59.69 90.17,54.61 90.17,52.07 90.17,50.8 v90.17,30.48
SDMOSI
  Bottom 0.406: V1.6 87.63,50.8 88.9,52.07 88.9,58.42 87.63,59.69 76.2,59.69 73.66,62.23 73.66,64.3 X2.2
SDSCK
  Bottom 0.406: V1.3 69.61,58.42 66.22,61.81 X2.5
SDSS
  Bottom 0.406: 76.2,63.84 X2.1 76.2,63.84 | V1.8 95.25,48.26 96.52,49.53 96.52,50.8 95.25,52.07 92.71,52.07 91.44,53.34 91.44,59.69 88.9,62.23 78.74,62.23 77.47,62.23 76.2,62.23 76.2,63.84
SWITCH
  Bottom 0.406: U$1.38 43.18,46.99 41.91,48.26 JP1.7
TX  (via drill 0.7)
  Top 0.406: v7.62,41.91 v13.97,41.91 | v29.21,60.96 v38.1,60.96
  Bottom 0.406: v38.1,60.96 50.8,60.96 52.07,60.96 58.42,60.96 U$1.25 | v7.62,41.91 5.08,39.37 5.08,21.59 6.35,20.32 8.89,17.78 15.24,17.78 20.32,12.7 20.5,12.52 X5.2 | JP2.3 15.24,45.72 15.24,48.26 17.78,48.26 24.13,48.26 24.13,55.88 v29.21,60.96
  Bottom 0.61: v13.97,41.91 JP2.3
TX_232
  Bottom 0.406: IC2.11 19.05,26.67 15.88,29.84 15.88,31.75 15.88,40.64 16.51,41.27 JP2.5
TX_USB
  Bottom 0.406: JP2.1 10.16,45.72 10.16,48.26 11.79,49.88 IC1.5
VCCIO
  Bottom 0.406: 9.19,56.17 IC1.20 | L1.2 9.19,56.17 | 12.44,52.92 IC1.4 | 9.19,56.17 12.44,52.92 | 12.44,52.92 12.85,53.34 15.24,53.34 17.78,53.34 LED3.A
  Bottom 0.61: C15.1 L1.2
VUSB
  Bottom 0.406: L1.1 C14.1
  Bottom 1.27: X1.1 7.99,65.14 C14.1